# Altium schematic sheet interface1.SchDoc
size A4
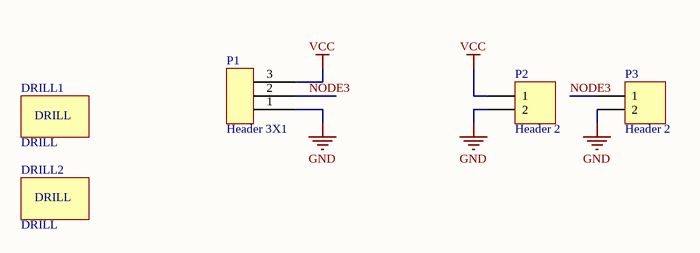
[diagram p0: interface1.SchDoc]

## Parts
DRILL1  DRILL  [DRILL_2MM]
DRILL2  DRILL  [DRILL_2MM]
P1  Header 3X1  [HDR3X1]
P2  Header 2  [HDR1X2]
P3  Header 2  [HDR1X2]

## Nets
GND: P1.1 P2.2 P3.2
VCC: P1.3 P2.1
NODE3: P1.2 P3.1

## Library data of the parts
P1 = Header 3X1: Header 3X1,3-Pin
P2 P3 = Header 2: Header, 2-Pin; LatestRevisionDate: 17-Jul-2002; LatestRevisionNote: Re-released for DXP Platform.; Publisher: Altium Limited